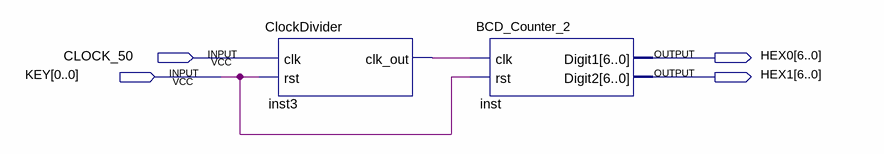
[diagram p0: schematic sheet]
// Quartus schematic Block_BCDCounter.bdf as structural Verilog: 2 symbols, 4 pins
module Block_BCDCounter (
  input  CLOCK_50,
  input  [0:0] KEY,
  output [6:0] HEX0,
  output [6:0] HEX1
);

  wire inst3_clk_out;

  ClockDivider inst3 (.clk(CLOCK_50), .rst(KEY[0]), .clk_out(inst3_clk_out));
  BCD_Counter_2 inst (.clk(inst3_clk_out), .rst(KEY[0]), .Digit1(HEX0), .Digit2(HEX1));
endmodule
